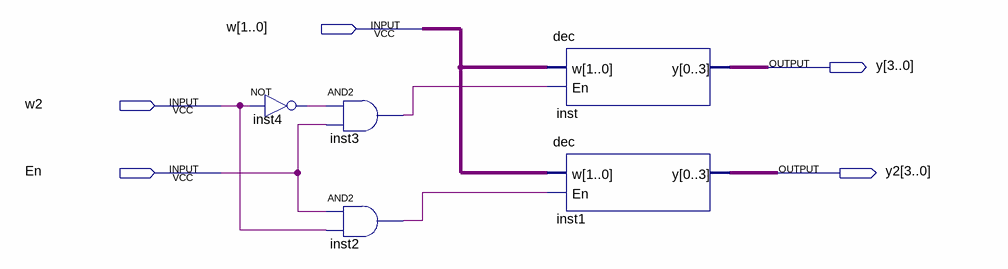
[diagram p0: schematic sheet]
// Quartus schematic 3to8dec.bdf as structural Verilog: 5 symbols, 5 pins
module \3to8dec  (
  input  [1:0] w,
  input  w2,
  input  En,
  output [3:0] y,
  output [3:0] y2
);

  wire inst2_out, inst3_out, inst4_out;

  not inst4 (inst4_out, w2);
  and inst3 (inst3_out, inst4_out, En);
  and inst2 (inst2_out, En, w2);
  dec inst (.w(w), .En(inst3_out), .y(y));
  dec inst1 (.w(w), .En(inst2_out), .y(y2));
endmodule
